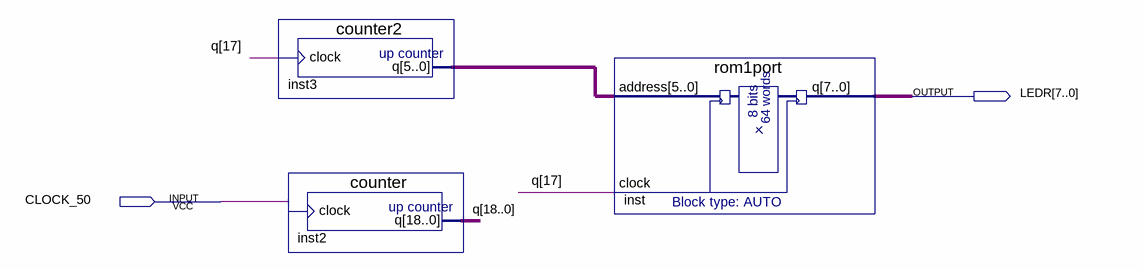
[diagram p0: schematic sheet]
// Quartus schematic pratica3.bdf as structural Verilog: 3 symbols, 2 pins
module pratica3 (
  input  CLOCK_50,
  output [7:0] LEDR
);

  wire [5:0] inst3_q;
  wire [18:0] q;

  counter2 inst3 (.clock(q[17]), .q(inst3_q));
  counter inst2 (.clock(CLOCK_50), .q(q));
  rom1port inst (.address(inst3_q), .clock(q[17]), .q(LEDR));
endmodule
